# Altium schematic sheet mcu_.SchDoc
size A3; SheetNumber: 2; SheetTotal: 3
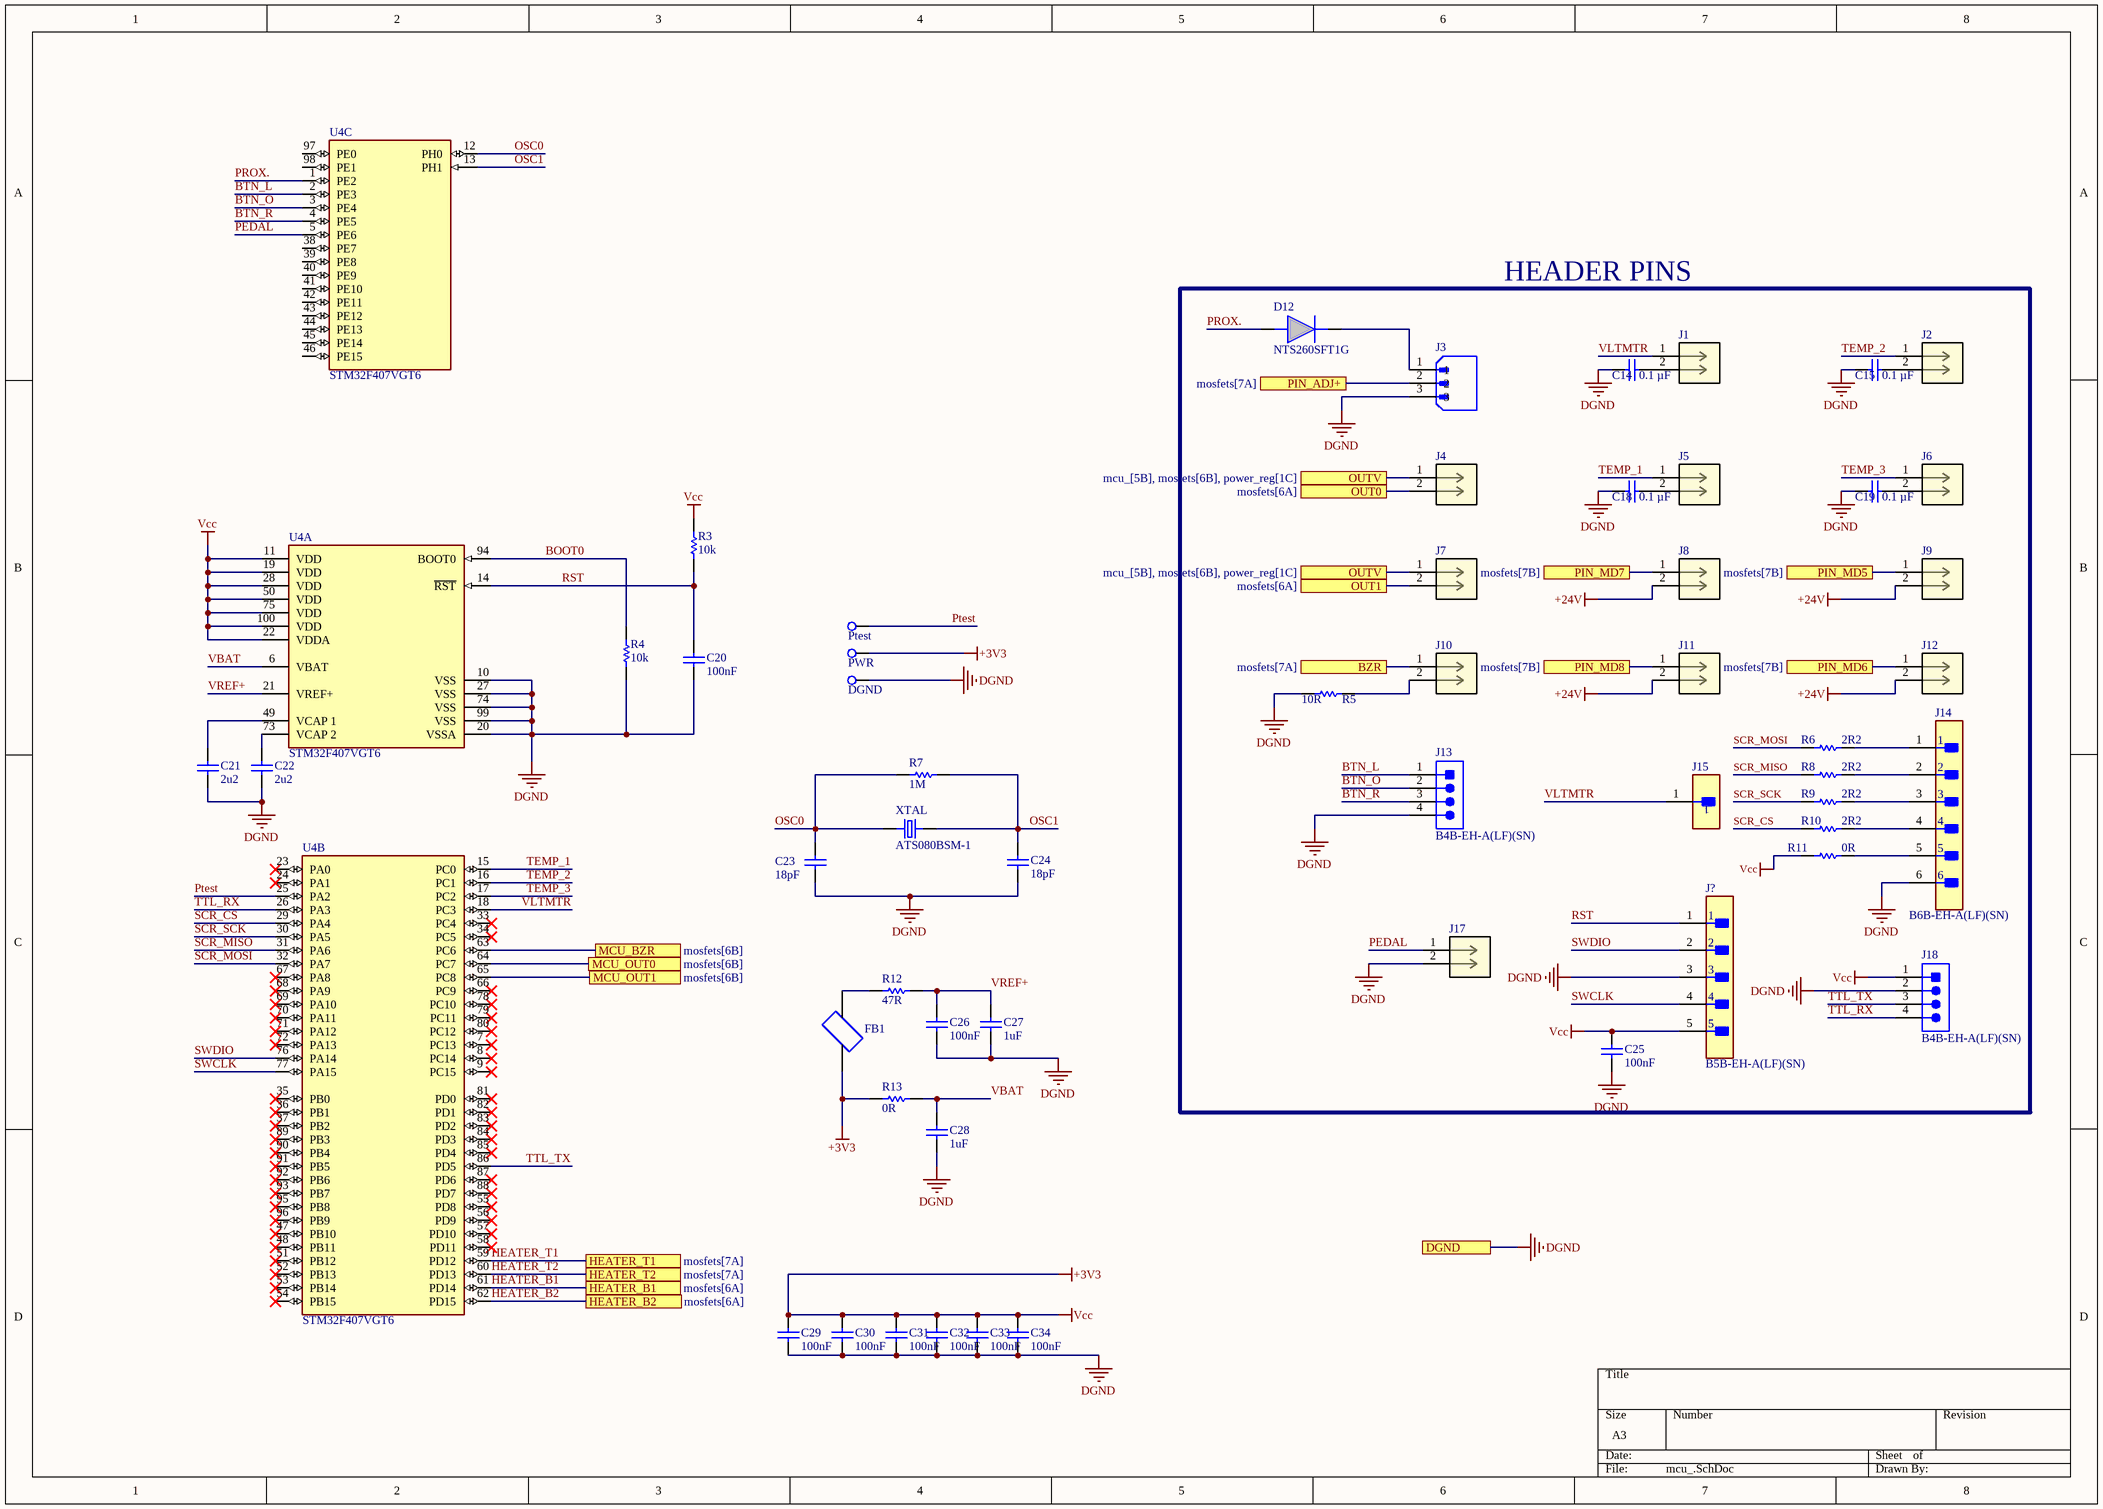
[diagram p0: mcu_.SchDoc]

## Parts
C14  Capacitance: 0.1 µF  [0603cap]  (hidden comment: CAP CER 0.1UF 25V X7R 0603)
C15  Capacitance: 0.1 µF  [0603cap]  (hidden comment: CAP CER 0.1UF 25V X7R 0603)
C18  Capacitance: 0.1 µF  [0603cap]  (hidden comment: CAP CER 0.1UF 25V X7R 0603)
C19  Capacitance: 0.1 µF  [0603cap]  (hidden comment: CAP CER 0.1UF 25V X7R 0603)
C20  Capacitance: 100nF  [0603 CAP]  (hidden comment: C0603C104K5RAC7867)
C21  Capacitance: 2u2  [0603cap]  (hidden comment: JMK107ABJ106MA-T)
C22  Capacitance: 2u2  [0603cap]  (hidden comment: JMK107ABJ106MA-T)
C23  Capacitance: 18pF  [0603 CAP]  (hidden comment: GCM1885C2A160JA16D)
C24  Capacitance: 18pF  [0603 CAP]  (hidden comment: GCM1885C2A160JA16D)
C25  Capacitance: 100nF  [0603 CAP]  (hidden comment: C0603C104K5RAC7867)
C26  Capacitance: 100nF  [0603 CAP]  (hidden comment: C0603C104K5RAC7867)
C27  Capacitance: 1uF  [0603 CAP]  (hidden comment: 1 µF ±10% 25V Ceramic Capacitor X5R 0603)
C28  Capacitance: 1uF  [0603 CAP]  (hidden comment: 1 µF ±10% 25V Ceramic Capacitor X5R 0603)
C29  Capacitance: 100nF  [0603 CAP]  (hidden comment: C0603C104K5RAC7867)
C30  Capacitance: 100nF  [0603 CAP]  (hidden comment: C0603C104K5RAC7867)
C31  Capacitance: 100nF  [0603 CAP]  (hidden comment: C0603C104K5RAC7867)
C32  Capacitance: 100nF  [0603 CAP]  (hidden comment: C0603C104K5RAC7867)
C33  Capacitance: 100nF  [0603 CAP]  (hidden comment: C0603C104K5RAC7867)
C34  Capacitance: 100nF  [0603 CAP]  (hidden comment: C0603C104K5RAC7867)
D12  NTS260SFT1G  [SODFL3616X98N]
DGND  (no value)  [TEST POINT]
FB1  BLM18AG601SN1D  [0603cap]  (value not drawn)
J1  JST CONN HEADER VERT 2POS 2.5MM  [CONN_B2B-EH-A (LF)(SN)_JST]  (value not drawn)
J2  JST CONN HEADER VERT 2POS 2.5MM  [CONN_B2B-EH-A (LF)(SN)_JST]  (value not drawn)
J3  JST CONN HEADER VERT 3POS 2.5MM  [JST_B3B-XH-A(LF)(SN)]  (value not drawn)
J4  JST CONN HEADER VERT 2POS 2.5MM  [CONN_B2B-EH-A (LF)(SN)_JST]  (value not drawn)
J5  JST CONN HEADER VERT 2POS 2.5MM  [CONN_B2B-EH-A (LF)(SN)_JST]  (value not drawn)
J6  JST CONN HEADER VERT 2POS 2.5MM  [CONN_B2B-EH-A (LF)(SN)_JST]  (value not drawn)
J7  JST CONN HEADER VERT 2POS 2.5MM  [CONN_B2B-EH-A (LF)(SN)_JST]  (value not drawn)
J8  JST CONN HEADER VERT 2POS 2.5MM  [CONN_B2B-EH-A (LF)(SN)_JST]  (value not drawn)
J9  JST CONN HEADER VERT 2POS 2.5MM  [CONN_B2B-EH-A (LF)(SN)_JST]  (value not drawn)
J10  JST CONN HEADER VERT 2POS 2.5MM  [CONN_B2B-EH-A (LF)(SN)_JST]  (value not drawn)
J11  JST CONN HEADER VERT 2POS 2.5MM  [CONN_B2B-EH-A (LF)(SN)_JST]  (value not drawn)
J12  JST CONN HEADER VERT 2POS 2.5MM  [CONN_B2B-EH-A (LF)(SN)_JST]  (value not drawn)
J13  B4B-EH-A(LF)(SN)  [JST-B4B-EH-A_V]
J14  B6B-EH-A(LF)(SN)  [FP-B6B-EH-A_LF_SN-MFG]
J15  TSW-101-07-L-S  [FP-TSW-101-07-L-S-MFG]  (value not drawn)
J17  JST CONN HEADER VERT 2POS 2.5MM  [CONN_B2B-EH-A (LF)(SN)_JST]  (value not drawn)
J18  B4B-EH-A(LF)(SN)  [JST-B4B-EH-A_V]
J?  B5B-EH-A(LF)(SN)  [FP-B5B-EH-A_LF_SN-MFG]
Ptest  (no value)  [TEST POINT]
PWR  (no value)  [TEST POINT]
R3  Resistance: 10k  [0603RES]  (hidden comment: Res  0603 10K Ohm 1% 1/10W)
R4  Resistance: 10k  [0603RES]  (hidden comment: Res  0603 10K Ohm 1% 1/10W)
R5  Resistance: 10R  [0603RES]  (hidden comment: Res  0603 10K Ohm 1% 1/10W)
R6  Resistance: 2R2  [0603RES]  (hidden comment: 2.2R Ohms Jumper Chip Resistor 0603)
R7  Resistance: 1M  [0603RES]  (hidden comment: TC0325F1004T5F)
R8  Resistance: 2R2  [0603RES]  (hidden comment: 2.2R Ohms Jumper Chip Resistor 0603)
R9  Resistance: 2R2  [0603RES]  (hidden comment: 2.2R Ohms Jumper Chip Resistor 0603)
R10  Resistance: 2R2  [0603RES]  (hidden comment: 2.2R Ohms Jumper Chip Resistor 0603)
R11  Resistance: 0R  [0603RES]  (hidden comment: 0 Ohms Jumper Chip Resistor 0603)
R12  Resistance: 47R  [0603RES]  (hidden comment: CQ03SAF470JT5E)
R13  Resistance: 0R  [0603RES]  (hidden comment: 0 Ohms Jumper Chip Resistor 0603)
U4  STM32F407VGT6  [FP-LQFP100-1L-MFG]  (parts A,B,C of 3)
XTAL  ATS080BSM-1  [ATS080BSM-1]

## Ports
BZR (see mosfets[7A]), DGND, HEATER_B1 (see mosfets[6A]), HEATER_B2 (see mosfets[6A]), HEATER_T1 (see mosfets[7A]), HEATER_T2 (see mosfets[7A]), MCU_BZR (see mosfets[6B]), MCU_OUT0 (see mosfets[6B]), MCU_OUT1 (see mosfets[6B]), OUT0 (see mosfets[6A]), OUT1 (see mosfets[6A]), OUTV (see mcu_[5B], mosfets[6B], power_reg[1C]), PIN_ADJ+ (see mosfets[7A]), PIN_MD5 (see mosfets[7B]), PIN_MD6 (see mosfets[7B]), PIN_MD7 (see mosfets[7B]), PIN_MD8 (see mosfets[7B])

## Nets
+3V3: C25.1 C29.1 C30.1 C31.1 C32.1 C33.1 C34.1 FB1.1 J18.1 J?.5 PWR.1(TP) R3.2 R11.1 R13.1 U4.11(VDD) U4.19(VDD) U4.22(VDDA) U4.28(VDD) U4.50(VDD) U4.75(VDD) U4.100(VDD)  [also labelled Vcc]
\: J4.2 J7.2 J8.2 J9.2 J10.2 J11.2 J12.2 R5.1 ; port OUT0, port OUT1  [also labelled +24V]
DGND: C14.1 C15.1 C18.1 C19.1 C20.2 C21.2 C22.2 C23.2 C24.2 C25.2 C26.2 C27.2 C28.2 C29.2 C30.2 C31.2 C32.2 C33.2 C34.2 DGND.1(TP) J3.3 J13.4 J14.6 J17.2 J18.2 J?.3 R4.1 R5.2 U4.10(VSS) U4.20(VSSA) U4.27(VSS) U4.74(VSS) U4.99(VSS) ; port DGND
BOOT0: R4.2 U4.94(BOOT0)
BTN_L: J13.1 U4.2(PE3)
BTN_O: J13.2 U4.3(PE4)
BTN_R: J13.3 U4.4(PE5)
BZR: J10.1 ; port BZR
HEATER_B1: U4.61(PD14) ; port HEATER_B1
HEATER_B2: U4.62(PD15) ; port HEATER_B2
HEATER_T1: U4.59(PD12) ; port HEATER_T1
HEATER_T2: U4.60(PD13) ; port HEATER_T2
MCU_BZR: U4.63(PC6) ; port MCU_BZR
MCU_OUT0: U4.64(PC7) ; port MCU_OUT0
MCU_OUT1: U4.65(PC8) ; port MCU_OUT1
OSC0: C23.1 R7.2 U4.12(PH0) XTAL.1
OSC1: C24.1 R7.1 U4.13(PH1) XTAL.2
OUTV: J4.1 J7.1 ; port OUTV
PEDAL: J17.1 U4.5(PE6)
PIN_ADJ+: J3.2 ; port PIN_ADJ+
PIN_MD5: J9.1 ; port PIN_MD5
PIN_MD6: J12.1 ; port PIN_MD6
PIN_MD7: J8.1 ; port PIN_MD7
PIN_MD8: J11.1 ; port PIN_MD8
PROX.: D12.2(A) U4.1(PE2)
Ptest: Ptest.1(TP) U4.25(PA2)
RST: C20.1 J?.1 R3.1 U4.14(~{RST})
SCR_CS: R10.1 U4.29(PA4)
SCR_MISO: R8.1 U4.31(PA6)
SCR_MOSI: R6.1 U4.32(PA7)
SCR_SCK: R9.1 U4.30(PA5)
SWCLK: J?.4 U4.77(PA15)
SWDIO: J?.2 U4.76(PA14)
TEMP_1: J5.1 U4.15(PC0)
TEMP_2: J2.1 U4.16(PC1)
TEMP_3: J6.1 U4.17(PC2)
TTL_RX: J18.4 U4.26(PA3)
TTL_TX: J18.3 U4.86(PD5)
VBAT: C28.1 R13.2 U4.6(VBAT)
VLTMTR: J1.1 J15.1 U4.18(PC3)
VREF+: C26.1 C27.1 R12.1 U4.21(VREF+)
NetC14_2: C14.2 J1.2
NetC15_2: C15.2 J2.2
NetC18_2: C18.2 J5.2
NetC19_2: C19.2 J6.2
NetC21_1: C21.1 U4.49(VCAP_1)
NetC22_1: C22.1 U4.73(VCAP_2)
NetD12_1: D12.1(K) J3.1
NetFB1_2: FB1.2 R12.2
NetJ14_1: J14.1 R6.2
NetJ14_2: J14.2 R8.2
NetJ14_3: J14.3 R9.2
NetJ14_4: J14.4 R10.2
NetJ14_5: J14.5 R11.2

Not connected (* = marked no-connect by the designer): U4 7(PC13)* 8(PC14)* 9(PC15)* 23(PA0)* 24(PA1)* 33(PC4)* 34(PC5)* 35(PB0)* 36(PB1)* 37(PB2)* 38(PE7) 39(PE8) 40(PE9) 41(PE10) 42(PE11) 43(PE12) 44(PE13) 45(PE14) 46(PE15) 47(PB10)* 48(PB11)* 51(PB12)* 52(PB13)* 53(PB14)* 54(PB15)* 55(PD8)* 56(PD9)* 57(PD10)* 58(PD11)* 66(PC9)* 67(PA8)* 68(PA9)* 69(PA10)* 70(PA11)* 71(PA12)* 72(PA13)* 78(PC10)* 79(PC11)* 80(PC12)* 81(PD0)* 82(PD1)* 83(PD2)* 84(PD3)* 85(PD4)* 87(PD6)* 88(PD7)* 89(PB3)* 90(PB4)* 91(PB5)* 92(PB6)* 93(PB7)* 95(PB8)* 96(PB9)* 97(PE0) 98(PE1)

## Notes on the sheet
- HEADER PINS

## Library data of the parts
C14 C15 C18 C19 = CAP CER 0.1UF 25V X7R 0603: 0.1 µF ±5% 25V Ceramic Capacitor X7R 0603 (1608 Metric); Manufacturer PN: C0603C104J3RACAUTO; Supplier 1: Digi-Key; Supplier Part Number 1: 399-12996-1-ND; Supplier PN: 399-12996-1-ND
C20 C25 C26 C29-C34 = C0603C104K5RAC7867: Ceramic Capacitors  SMD 50volts 0.1uF X7R 10%; Supplier: OZDISAN; ComponentLink1Description: Supplier Link
  C20 C25 C26 C31-C34: Supplier PN: CL10B104KB8NNNC; ComponentLink1URL: https://www.ozdisan.com/pasif-komponentler/kondansatorler/smt-smd-ve-mlcc-kondansatorler/CL10B104KB8NNNC
  C29 C30: Supplier PN: CL10A105KO8NNNC; ComponentLink1URL: https://www.ozdisan.com/pasif-komponentler/kondansatorler/smt-smd-ve-mlcc-kondansatorler/CL10A105KO8NNNC
C21 C22 = GRM188R61E225KA12D: 2.2 µF ±10% 25V Ceramic Capacitor X5R 0603; Manufacturer: Murata; Designed By: Baran; ComponentLink1Description: https://datasheet.ciiva.com/22706/1747460-22706787.pdf?src-supplier=Element14; ComponentLink1URL: https://datasheet.ciiva.com/22706/1747460-22706787.pdf?src-supplier=Element14; Supplier 1: Digi-Key; Manufacturer Part Number: GRM188R61E225KA12D; RoHS: Yes; Category: Ceramic Capacitors; Stock 1: 503975; Pricing 1: 1=0.17000, 10=0.12200, 50=0.06940, 100=0.05750, 500=0.04034, 1000=0.03339 (USD); Mount: Surface Mount; Case/Package: 0603; Number of Pins: 2; Case Code (Metric): 1608; Case Code (Imperial): 0603; Material: Ceramic; Weight: 0.000222oz; Min Operating Temperature: -55°C; Max Operating Temperature: 85°C; Tolerance: 10%; Dielectric: X5R; Voltage Rating: 25V; Packaging: Tape and Reel; Voltage: 25V; Termination: SMD/SMT; Resistor Type: Ceramic; Voltage Rating (DC): 25V; Package Quantity: 4000; Series: GRM; Construction: Flat; Length: 1.6mm; Width: 0.8mm; Height: 0.8mm; Thickness: 0.035inch; Depth: 0.8mm; Radiation Hardening: No; REACH SVHC: No SVHC; Lead Free: Lead Free; RoHS Compliant: Yes; ComponentLink2URL: https://datasheet.ciiva.com/7719/1747460-7719045.pdf?src-supplier=Element14; ComponentLink2Description: https://datasheet.ciiva.com/7719/1747460-7719045.pdf?src-supplier=Element14; ComponentLink3URL: https://datasheet.ciiva.com/14116/grmseries-highdielectrictype-eng-14116409.pdf?src-supplier=Distrelec; ComponentLink3Description: https://datasheet.ciiva.com/14116/grmseries-highdielectrictype-eng-14116409.pdf?src-supplier=Distrelec; Supplier Part Number 1: 490-10731-1-ND
C23 C24 = C0603C104K5RAC7867: 18 pF ±5% 50V Ceramic Capacitor C0G, NP0 0603 (1608 Metric); Supplier PN: CL10C180JB81PNC; Supplier: OZDISAN; ComponentLink1Description: Supplier Link; ComponentLink1URL: https://www.ozdisan.com/pasif-komponentler/kondansatorler/smt-smd-ve-mlcc-kondansatorler/CL10C180JB81PNC
C27 C28 = C0603C104K5RAC7867: Supplier PN: CL10A105KO8NNNC; Supplier: OZDISAN; ComponentLink1Description: Supplier Link; ComponentLink1URL: https://www.ozdisan.com/pasif-komponentler/kondansatorler/smt-smd-ve-mlcc-kondansatorler/CL10A105KO8NNNC
D12 = NTS260SFT1G: Fine Lithography Trenchbased Schottky Technology for Very Low Forward Voltage and Low Leakage; Fast Switching with Exceptional Temperature Stability; Low Power Loss and Lower Operating Temperature; Higher Efficiency for Achieving Regulatory Compliance; Low Thermal Resistance; High Surge Capability; These are PbFree and HalideFree Devices; Manufacturer_Name: onsemi; Geometry.Height: 0.98mm; Manufacturer_Part_Number: NTS260SFT1G; Mouser Part Number: 863-NTS260SFT1G; Mouser Price/Stock: https://www.mouser.co.uk/ProductDetail/onsemi/NTS260SFT1G?qs=k6dkFvHqcvCML1heMZjMng%3D%3D; Arrow Part Number: NTS260SFT1G; Arrow Price/Stock: https://www.arrow.com/en/products/nts260sft1g/on-semiconductor; Datasheet Link: https://www.onsemi.com/pub/Collateral/NTS260SF-D.PDF
DGND PWR = Test Point_2: PROBE PAD; ComponentLink1Description: Datasheet; Type: PC Test Point; Mounting Type: Surface Mount
FB1 = FBMH1608HM102-TV: FERRITE BEAD 0603 600R 500MA MURATA; Test Frequency: 100MHz; Impedance: 600R; Max. Current: 500mA; Supplier PN: BLM18AG601SN1D; Supplier: OZDISAN; ComponentLink1Description: Supplier Link; ComponentLink1URL: https://www.ozdisan.com/pasif-komponentler/induktorler/bead-feritler/BLM18AG601SN1D
J1 J2 J4-J12 J17 = B2B-EH-A (LF)(SN): Connector Header Through Hole 2 position 0.098" (2.50mm); Copyright: Copyright (C) 2023 Ultra Librarian. All rights reserved.; Mfr_Name: JST; Manufacturer_Part_Number: B2B-EH-A (LF)(SN); Digi-Key_Part_Number_1: 455-1611-ND; RefDes: RefDes; Type: DEV; Supplier PN: 455-1611-ND; Manufacturer PN: B2B-EH-A(LF)(SN)
J3 = B3B-XH-A(LF)(SN): Connector Header Through Hole 3 position 0.098" (2.50mm); MF: JST Sales; Check_prices: https://www.snapeda.com/parts/B3B-XH-A(LF)(SN)/JST+Sales+America+Inc./view-part/?ref=eda; Value: *; Availability: In Stock; MP: B3B-XH-A(LF)(SN); Price: None; Package: None; SnapEDA_Link: https://www.snapeda.com/parts/B3B-XH-A(LF)(SN)/JST+Sales+America+Inc./view-part/?ref=snap; Purchase-URL: https://pricing.snapeda.com/search/part/B3B-XH-A(LF)(SN)/?ref=eda; Manufacturer PN: B3B-XH-A(LF)(SN); Supplier PN: 455-2248-ND
J13 J18 = CMP-2000-05904-1: Male Header, Pitch 2.5 mm, 1 x 4 Position, Height 6 mm, Tail Length 3.2 mm, -25 to 85 degC, RoHS, Bulk; Manufacturer: JST; Style/Orientation: StraightHeader/Plug; Pitch: 2.5mm; No of Positions: 4; Mounting Technology: SurfaceMount; Package Description: Male Header, Pitch 2.5 mm, 1 x 4 Position, Height 6 mm, Tail Length 3.2 mm; Datasheet Version: 12/2012; Type: ShroudedHeader; Package Reference: B4B-EH-A; Manufacturer URL: http://www.jst.com/home2.html; Termination: Crimp; Datasheet URL: http://www.jst-mfg.com/product/pdf/eng/eEH.pdf
J14 = CMP-17439-000293-1: CONN HEADER VERT 6POS 2.5MM; Voltage Rating: 250V; Number of Positions: 6; Current Rating: 3A; Mated Stacking Heights: 8.1mm; Gender: Male; Insulation Material: Nylon; Number of Contacts: 6; Contact Plating: Tin; Pitch: 2.5mm; Orientation: Straight; Insulation Color: Natural; Packaging: Bulk; Termination: Solder; Flammability Rating: UL94 V-0; Lead Free: Lead Free; Contact Mating Length: 0.13inch; Color: Natural; Contact Finish - Mating: TIN; Connector Type: Header; Contact Shape: Square; Contact Type: Male Pin; Series: EH; Contact Material: Brass; Fastening Type: Friction; Number of Rows: 1; Mount: Through Hole; Housing Color: White
J15 = CMP-02766-001775-1: CONN HEADER VERT 1POS; Gender: Male; Number of Contacts: 1; Max Current Rating: 7.6A; Max Voltage Rating (AC): 550V; RoHS Compliant: Yes; Contact Finish - Mating: GOLD; Length: 2.54mm; Series: TSW; Insulation Material: PBT; Reach SVHC Compliant: Yes; Radiation Hardening: No; Contact Plating: Gold; Termination: Solder; Contact Type: Male Pin; Orientation: Straight; Number of Rows: 1; Depth: 2.54mm; Housing Material: Polyester; Lead Free: Lead Free; Fastening Type: Pull; Flammability Rating: UL94 V-0; Mount: Through Hole; Housing Color: Black; Contact Shape: Square; Min Operating Temperature: -55°C; Connector Type: Header; Contact Mating Length: 0.23inch; Width: 2.54mm; Packaging: Bulk; Contact Material: Bronze; Max Operating Temperature: 125°C; Number of Positions: 1; Color: Black; Insulation Color: Black
J? = CMP-17439-000382-1: CONN HEADER VERT 5POS 2.5MM; Number of Contacts: 5; Mated Stacking Heights: 8.1mm; Current Rating: 3A; Gender: Male; Voltage Rating: 250V; Lead Free: Lead Free; Fastening Type: Friction; Contact Type: Male Pin; Insulation Color: Natural; Insulation Material: Nylon; Contact Material: Brass; Contact Mating Length: 0.13inch; Pitch: 2.5mm; Number of Positions: 5; Number of Rows: 1; Connector Type: Header; Color: Natural; Contact Shape: Square; Flammability Rating: UL94 V-0; Orientation: Straight; Packaging: Bulk; Mount: Through Hole; Contact Finish - Mating: TIN; Contact Plating: Tin; Series: EH; Termination: Solder; Housing Color: White
Ptest = Test Point_2: Ptest; ComponentLink1Description: Datasheet; Type: PC Test Point; Mounting Type: Surface Mount
R3-R5 = RC0603FR-0710KL: Supplier PN: TC0325B1002T5F; Supplier: OZDISAN; ComponentLink1Description: Supplier Link; ComponentLink1URL: https://www.ozdisan.com/pasif-komponentler/direncler/smt-smd-ve-cip-direncler/TC0325B1002T5F
R6 R8-R11 = RC0603FR-071ML: ComponentLink1Description: Supplier Link
R7 = RC0603FR-0710KL: RES.(1608) 0603 1M Ohms 1% 1/10W 25PPM; Supplier PN: TC0325F1004T5F; Supplier: OZDISAN; ComponentLink1Description: Supplier Link; ComponentLink1URL: https://www.ozdisan.com/pasif-komponentler/direncler/smt-smd-ve-cip-direncler/TC0325F1004T5F
R12 = RC0603FR-07100RL: RES.(1608) 0603 47 Ohms 1% 1/10W AUTOMOTIV; Supplier PN: CQ03SAF470JT5E; Supplier: OZDISAN; ComponentLink1Description: Supplier Link; ComponentLink1URL: https://www.ozdisan.com/pasif-komponentler/direncler/smt-smd-ve-cip-direncler/CQ03SAF470JT5E
R13 = CRCW06030000Z0EAC: Manufacturer: Vishay; Designed By: Baran; Power Rating: 100mW; Supplier 1: Digi-Key; Manufacturer Part Number: CRCW06030000Z0EAC; RoHS: Yes; Category: Chip SMD Resistors; Stock 1: 517672; Pricing 1: 1=0.10000, 10=0.02900, 100=0.01190, 1000=0.00533, 2500=0.00463 (USD); Mount: Surface Mount; Case/Package: Molded; Contact Plating: Tin; Min Operating Temperature: -55°C; Max Operating Temperature: 155°C; Resistor Type: Thick Film; Termination: Wraparound; Length: 1.55mm; Lead Free: Lead Free; RoHS Compliant: Yes; ComponentLink1URL: http://www.vishay.com/docs/28773/crcwce3.pdf?src-supplier=Digi-Key; ComponentLink1Description: http://www.vishay.com/docs/28773/crcwce3.pdf?src-supplier=Digi-Key; Supplier Part Number 1: 541-4012-1-ND
U4 = CMP-0243-00017-5: NexarPartId: 20570110; Manufacturer Package Identifier: 1L_ME_V5; Peripherals: Brown-out Detect/Reset, DMA, I2C, LCD, POR, PWM, WDT; Number of Programmable I/O: 82; Oscillator Type: Internal; Nominal Supply Current: 1.7µA; Number of Timers/Counters: 14; RAM Size: 192kB; Number of D/A Converters: 2; Number of Ethernet Channels: 1; Max Frequency: 168MHz; Number of SPI Channels: 3; Data Bus Width: 32b; Number of ADC Channels: 16; Max Supply Voltage: 3.6V; Number of USART Channels: 4; Interface: CAN, Ethernet, I2C, I2S, IrDA, LIN, SPI, UART, USART, USB; Max Junction Temperature (Tj): 125°C; Core Architecture: ARM Cortex-M4; Watchdog Timer: Yes; Memory Size: 1MB; Memory Type: FLASH; Min Supply Voltage: 1.8V; Number of I/Os: 82; Lead Free: Lead Free; Lifecycle Status: Production; Radiation Hardening: No; Frequency: 168MHz; Max Operating Temperature: 85°C; Height: 1.45mm; Number of Pins: 100; Number of I2C Channels: 3; Number of USB Channels: 1; REACH SVHC: No SVHC; Length: 14.2mm; Ambient Temperature Range High: 85°C; Schedule B: 8542310000, 8542310000; Number of Channels: 16; Number of A/D Converters: 3; Width: 14.2mm; Case/Package: LQFP; Flash Memory Size: 1MB; Min Operating Temperature: -40°C; Address Bus Width: 32b; Number of UART Channels: 2; RoHS: Compliant; Number of PWM Channels: 2